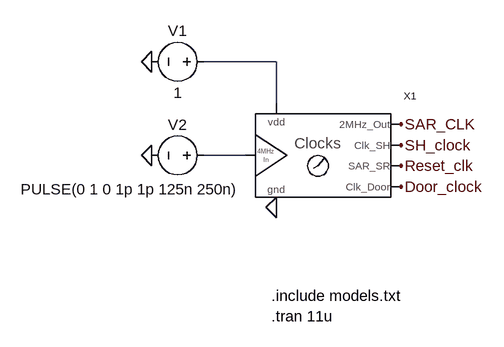
[diagram p0: schematic sim_Clocks_Block.asc]
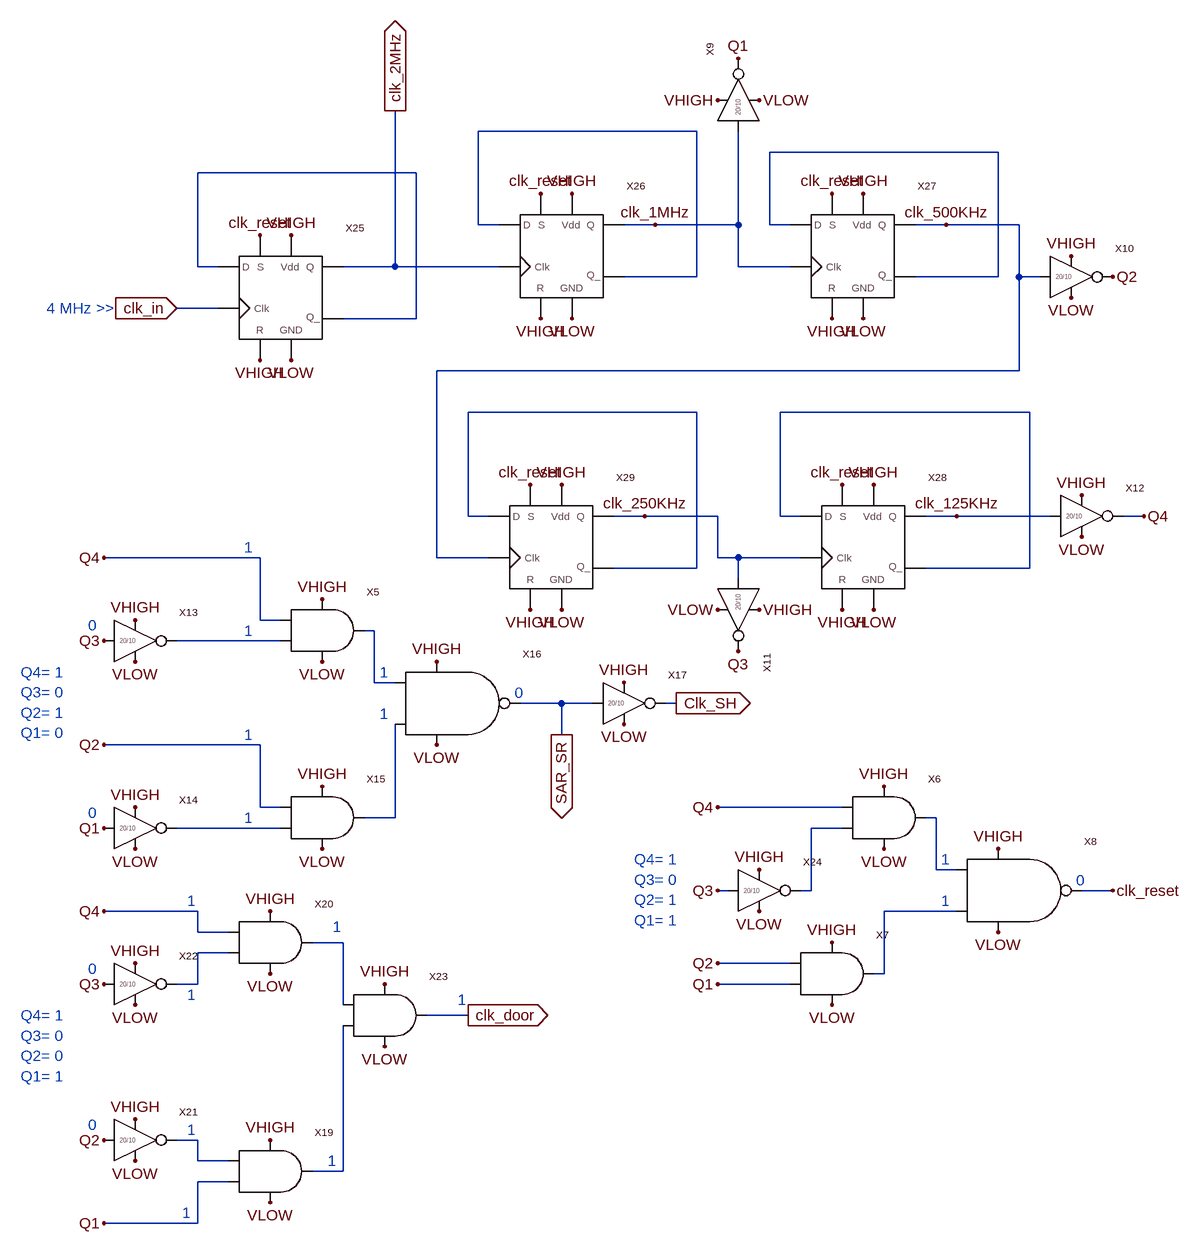
[diagram p1: sub-circuit clocks_block.asc]
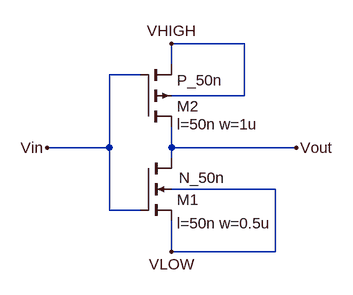
[diagram p2: sub-circuit inverter.asc]
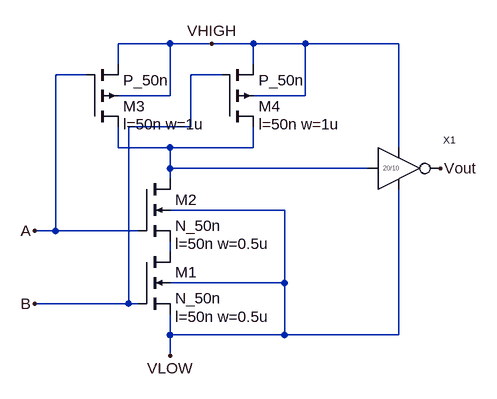
[diagram p3: sub-circuit and_t.asc]
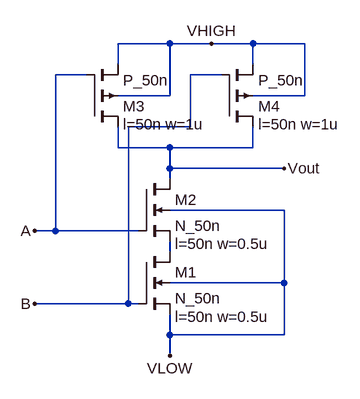
[diagram p4: sub-circuit nand.asc]
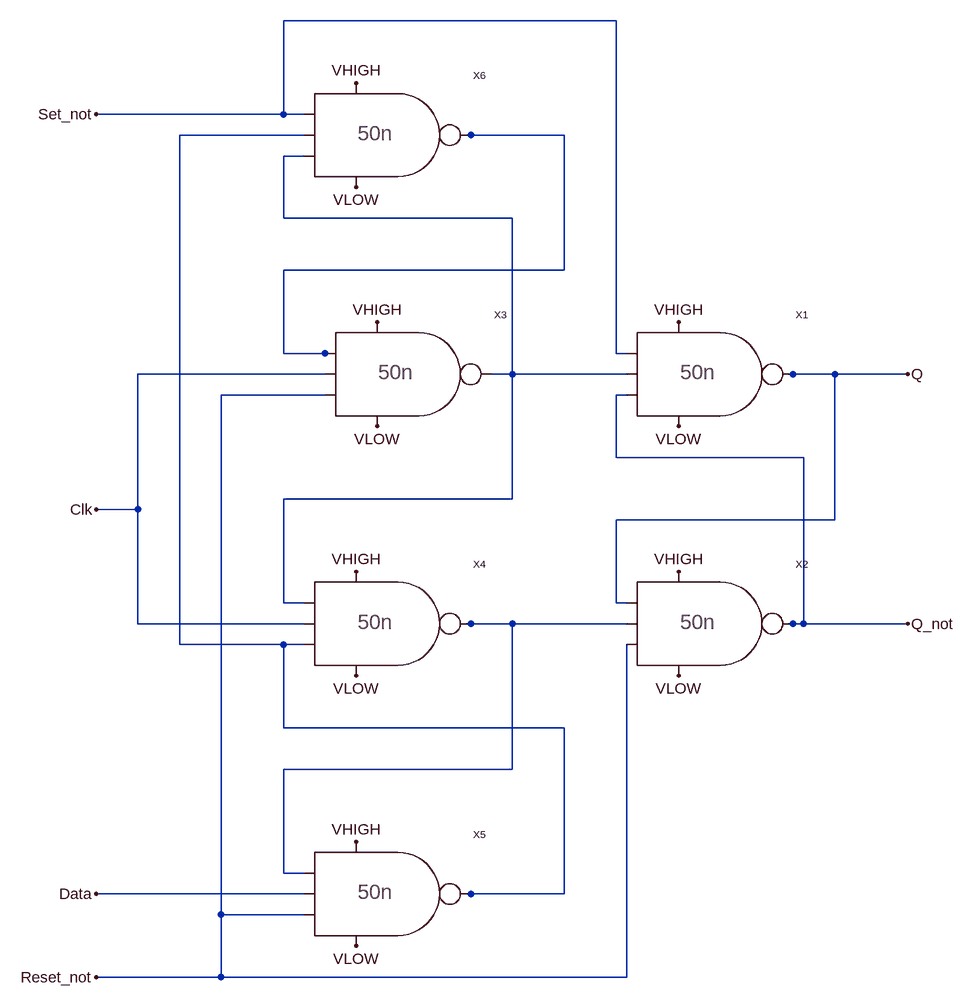
[diagram p5: sub-circuit ti_dff.asc]
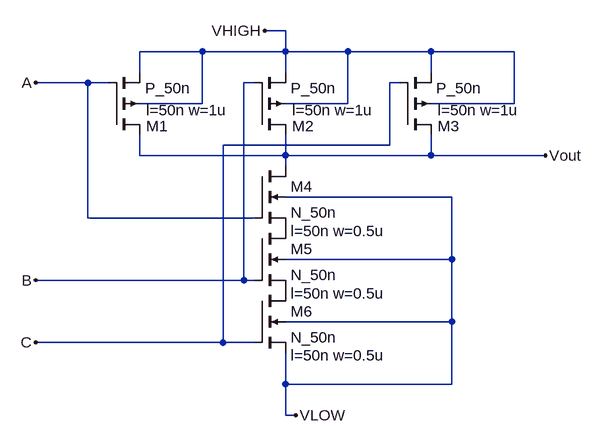
[diagram p6: sub-circuit nand3.asc]
sim_Clocks_Block.asc, the LTspice schematic file:
Version 4
SHEET 1 880 680
WIRE 272 112 160 112
WIRE 272 176 272 112
WIRE 224 256 160 256
FLAG 464 208 SAR_CLK
FLAG 464 240 SH_clock
FLAG 464 272 Reset_clk
FLAG 464 304 Door_clock
FLAG 80 256 0
FLAG 80 112 0
FLAG 272 336 0
SYMBOL voltage 176 112 R90
WINDOW 0 -32 56 VBottom 2
WINDOW 3 32 56 VTop 2
SYMATTR InstName V1
SYMATTR Value 1
SYMBOL voltage 176 256 R90
WINDOW 0 -32 56 VBottom 2
WINDOW 3 36 129 VTop 2
SYMATTR InstName V2
SYMATTR Value PULSE(0 1 0 1p 1p 125n 250n)
SYMBOL Clocks_Block 336 272 R0
SYMATTR InstName X1
TEXT 264 472 Left 2 !.include models.txt\n.tran 11u

clocks_block.asc, the sub-circuit schematic file:
Version 4
SHEET 1 3052 1676
WIRE 720 -112 384 -112
WIRE 1184 -80 832 -80
WIRE 288 -48 -48 -48
WIRE 384 32 384 -112
WIRE 416 32 384 32
WIRE 656 32 608 32
WIRE 784 32 784 -112
WIRE 784 32 656 32
WIRE 832 32 832 -80
WIRE 864 32 832 32
WIRE 1104 32 1056 32
WIRE 1216 32 1104 32
WIRE -48 96 -48 -48
WIRE -16 96 -48 96
WIRE 256 96 256 -144
WIRE 256 96 176 96
WIRE 416 96 256 96
WIRE 784 96 784 32
WIRE 864 96 784 96
WIRE 720 112 720 -112
WIRE 720 112 608 112
WIRE 1184 112 1184 -80
WIRE 1184 112 1056 112
WIRE 1216 112 1216 32
WIRE 1248 112 1216 112
WIRE -16 160 -80 160
WIRE 288 176 288 -48
WIRE 288 176 176 176
WIRE 1216 256 1216 112
WIRE 1216 256 320 256
WIRE 720 320 368 320
WIRE 1232 320 848 320
WIRE 368 480 368 320
WIRE 400 480 368 480
WIRE 640 480 592 480
WIRE 752 480 640 480
WIRE 848 480 848 320
WIRE 880 480 848 480
WIRE 1120 480 1072 480
WIRE 1264 480 1120 480
WIRE 1408 480 1376 480
WIRE 48 544 -192 544
WIRE 320 544 320 256
WIRE 400 544 320 544
WIRE 752 544 752 480
WIRE 784 544 752 544
WIRE 880 544 784 544
WIRE 720 560 720 320
WIRE 720 560 592 560
WIRE 1232 560 1232 320
WIRE 1232 560 1072 560
WIRE 784 576 784 544
WIRE 48 640 48 544
WIRE 80 640 48 640
WIRE 224 656 208 656
WIRE 80 672 -80 672
WIRE 224 736 224 656
WIRE 256 736 224 736
WIRE 512 768 448 768
WIRE 560 768 512 768
WIRE 688 768 672 768
WIRE 512 816 512 768
WIRE 48 832 -192 832
WIRE 48 928 48 832
WIRE 80 928 48 928
WIRE 944 928 752 928
WIRE 256 944 256 800
WIRE 256 944 208 944
WIRE 1088 944 1072 944
WIRE 80 960 -80 960
WIRE 944 960 896 960
WIRE 1088 1024 1088 944
WIRE 1120 1024 1088 1024
WIRE 768 1056 752 1056
WIRE 896 1056 896 960
WIRE 896 1056 880 1056
WIRE 1360 1056 1312 1056
WIRE -48 1088 -192 1088
WIRE 1120 1088 1008 1088
WIRE -48 1120 -48 1088
WIRE 0 1120 -48 1120
WIRE 176 1136 128 1136
WIRE 0 1152 -48 1152
WIRE 864 1168 752 1168
WIRE 1008 1184 1008 1088
WIRE 1008 1184 992 1184
WIRE -48 1200 -48 1152
WIRE -48 1200 -80 1200
WIRE 864 1200 752 1200
WIRE 176 1232 176 1136
WIRE 368 1248 304 1248
WIRE -48 1440 -80 1440
WIRE -48 1472 -48 1440
WIRE 0 1472 -48 1472
WIRE 176 1488 176 1264
WIRE 176 1488 128 1488
WIRE 0 1504 -48 1504
WIRE -48 1568 -48 1504
WIRE -48 1568 -192 1568
FLAG -80 160 clk_in
IOPIN -80 160 In
FLAG 656 32 clk_1MHz
FLAG 1104 32 clk_500KHz
FLAG 640 480 clk_250KHz
FLAG 784 -224 Q1
FLAG 1360 112 Q2
FLAG 784 688 Q3
FLAG 1408 480 Q4
FLAG -192 960 Q1
FLAG -192 832 Q2
FLAG -192 672 Q3
FLAG -192 544 Q4
FLAG 512 816 SAR_SR
IOPIN 512 816 Out
FLAG 688 768 Clk_SH
IOPIN 688 768 Out
FLAG 256 -144 clk_2MHz
IOPIN 256 -144 Out
FLAG 96 240 VLOW
FLAG 48 240 VHIGH
FLAG 1120 480 clk_125KHz
FLAG -192 1568 Q1
FLAG -192 1440 Q2
FLAG -192 1200 Q3
FLAG -192 1088 Q4
FLAG 368 1248 clk_door
IOPIN 368 1248 Out
FLAG 96 48 VHIGH
FLAG 528 -16 VHIGH
FLAG 480 176 VHIGH
FLAG 752 -160 VHIGH
FLAG 528 176 VLOW
FLAG 816 -160 VLOW
FLAG 752 1200 Q1
FLAG 752 1056 Q3
FLAG 752 928 Q4
FLAG 752 1168 Q2
FLAG 1360 1056 clk_reset
FLAG 944 432 clk_reset
FLAG 464 432 clk_reset
FLAG 480 -16 clk_reset
FLAG 48 48 clk_reset
FLAG 928 -16 clk_reset
FLAG 976 -16 VHIGH
FLAG 992 432 VHIGH
FLAG 944 624 VHIGH
FLAG 464 624 VHIGH
FLAG 512 624 VLOW
FLAG 992 624 VLOW
FLAG 976 176 VLOW
FLAG 928 176 VHIGH
FLAG 512 432 VHIGH
FLAG 816 624 VHIGH
FLAG 752 624 VLOW
FLAG 1312 448 VHIGH
FLAG 1312 512 VLOW
FLAG 608 800 VLOW
FLAG 608 736 VHIGH
FLAG 320 704 VHIGH
FLAG 144 608 VHIGH
FLAG 144 896 VHIGH
FLAG -144 928 VHIGH
FLAG -144 640 VHIGH
FLAG 64 1088 VHIGH
FLAG -144 1168 VHIGH
FLAG -144 1408 VHIGH
FLAG 64 1440 VHIGH
FLAG 240 1200 VHIGH
FLAG 1008 896 VHIGH
FLAG 1184 992 VHIGH
FLAG 928 1136 VHIGH
FLAG 1008 992 VLOW
FLAG 1184 1120 VLOW
FLAG 928 1232 VLOW
FLAG 816 1024 VHIGH
FLAG 816 1088 VLOW
FLAG 320 832 VLOW
FLAG 144 704 VLOW
FLAG -144 704 VLOW
FLAG -144 992 VLOW
FLAG 144 992 VLOW
FLAG 240 1296 VLOW
FLAG 64 1536 VLOW
FLAG 64 1184 VLOW
FLAG -144 1232 VLOW
FLAG -144 1472 VLOW
FLAG 1296 144 VLOW
FLAG 1296 80 VHIGH
SYMBOL Inverter 784 -128 R270
SYMATTR InstName X9
SYMBOL Inverter 1264 112 R0
SYMATTR InstName X10
SYMBOL Inverter 784 592 R90
SYMATTR InstName X11
SYMBOL Inverter 1280 480 R0
SYMATTR InstName X12
SYMBOL AND_T 96 656 R0
SYMATTR InstName X5
SYMBOL Inverter -176 672 R0
SYMATTR InstName X13
SYMBOL Inverter -176 960 R0
SYMATTR InstName X14
SYMBOL AND_T 96 944 R0
SYMATTR InstName X15
SYMBOL NAND 272 768 R0
SYMATTR InstName X16
SYMBOL Inverter 576 768 R0
SYMATTR InstName X17
SYMBOL Inverter -176 1440 R0
SYMATTR InstName X21
SYMBOL Inverter -176 1200 R0
SYMATTR InstName X22
SYMBOL AND_T 16 1488 R0
SYMATTR InstName X19
SYMBOL AND_T 16 1136 R0
SYMATTR InstName X20
SYMBOL AND_T 192 1248 R0
SYMATTR InstName X23
SYMBOL AND_T 960 944 R0
SYMATTR InstName X6
SYMBOL AND_T 880 1184 R0
SYMATTR InstName X7
SYMBOL NAND 1136 1056 R0
SYMATTR InstName X8
SYMBOL Inverter 784 1056 R0
SYMATTR InstName X24
SYMBOL TI_DFF 80 144 R0
SYMATTR InstName X25
SYMBOL TI_DFF 512 80 R0
SYMATTR InstName X26
SYMBOL TI_DFF 960 80 R0
SYMATTR InstName X27
SYMBOL TI_DFF 976 528 R0
SYMATTR InstName X28
SYMBOL TI_DFF 496 528 R0
SYMATTR InstName X29
TEXT -320 720 Left 2 ;Q4= 1\nQ3= 0\nQ2= 1\nQ1= 0
TEXT -216 648 Left 2 ;0
TEXT -216 936 Left 2 ;0
TEXT 24 528 Left 2 ;1
TEXT 24 656 Left 2 ;1
TEXT 24 816 Left 2 ;1
TEXT 24 944 Left 2 ;1
TEXT 232 784 Left 2 ;1
TEXT 232 720 Left 2 ;1
TEXT 440 752 Left 2 ;0
TEXT -320 1248 Left 2 ;Q4= 1\nQ3= 0\nQ2= 0\nQ1= 1
TEXT -216 1176 Left 2 ;0
TEXT -216 1416 Left 2 ;0
TEXT -64 1072 Left 2 ;1
TEXT -64 1216 Left 2 ;1
TEXT -64 1424 Left 2 ;1
TEXT -72 1552 Left 2 ;1
TEXT 152 1472 Left 2 ;1
TEXT 160 1112 Left 2 ;1
TEXT 352 1224 Left 2 ;1
TEXT -280 160 Left 2 ;4 MHz >>
TEXT 1096 1072 Left 2 ;1
TEXT 1096 1008 Left 2 ;1
TEXT 1304 1040 Left 2 ;0
TEXT 624 1008 Left 2 ;Q4= 1\nQ3= 0\nQ2= 1\nQ1= 1

inverter.asc, the sub-circuit schematic file:
Version 4
SHEET 1 880 680
WIRE 336 -64 224 -64
WIRE 224 -32 224 -64
WIRE 176 -16 128 -16
WIRE 336 16 336 -64
WIRE 336 16 224 16
WIRE 128 96 128 -16
WIRE 128 96 32 96
WIRE 224 96 224 64
WIRE 416 96 224 96
WIRE 224 112 224 96
WIRE 384 160 224 160
WIRE 128 192 128 96
WIRE 176 192 128 192
WIRE 224 256 224 208
WIRE 384 256 384 160
WIRE 384 256 224 256
FLAG 32 96 Vin
FLAG 224 256 VLOW
FLAG 224 -64 VHIGH
FLAG 416 96 Vout
SYMBOL nmos4 176 112 R0
WINDOW 123 56 100 Left 2
WINDOW 0 56 64 Left 2
WINDOW 3 59 30 Left 2
SYMATTR Value2 l=50n w=0.5u
SYMATTR InstName M1
SYMATTR Value N_50n
SYMBOL pmos4 176 64 M180
WINDOW 123 56 4 Left 2
SYMATTR Value2 l=50n w=1u
SYMATTR InstName M2
SYMATTR Value P_50n

and_t.asc, the sub-circuit schematic file:
Version 4
SHEET 1 880 680
WIRE 224 -128 144 -128
WIRE 288 -128 224 -128
WIRE 352 -128 288 -128
WIRE 432 -128 352 -128
WIRE 576 -128 432 -128
WIRE 144 -96 144 -128
WIRE 352 -96 352 -128
WIRE 96 -80 48 -80
WIRE 304 -80 256 -80
WIRE 224 -48 224 -128
WIRE 224 -48 144 -48
WIRE 432 -48 432 -128
WIRE 432 -48 352 -48
WIRE 256 0 256 -80
WIRE 256 0 160 0
WIRE 144 32 144 0
WIRE 224 32 144 32
WIRE 352 32 352 0
WIRE 352 32 224 32
WIRE 576 32 576 -128
WIRE 224 64 224 32
WIRE 528 64 224 64
WIRE 224 80 224 64
WIRE 400 128 224 128
WIRE 48 160 48 -80
WIRE 48 160 16 160
WIRE 176 160 48 160
WIRE 224 192 224 176
WIRE 400 240 400 128
WIRE 400 240 224 240
WIRE 160 272 160 0
WIRE 160 272 16 272
WIRE 176 272 160 272
WIRE 224 320 224 288
WIRE 400 320 400 240
WIRE 400 320 224 320
WIRE 576 320 576 96
WIRE 576 320 400 320
WIRE 224 352 224 320
FLAG 16 160 A
FLAG 16 272 B
FLAG 224 352 VLOW
FLAG 288 -128 VHIGH
FLAG 640 64 Vout
SYMBOL nmos4 176 192 R0
WINDOW 123 56 100 Left 2
SYMATTR Value2 l=50n w=0.5u
SYMATTR InstName M1
SYMATTR Value N_50n
SYMBOL nmos4 176 80 R0
WINDOW 123 56 100 Left 2
SYMATTR Value2 l=50n w=0.5u
SYMATTR InstName M2
SYMATTR Value N_50n
SYMBOL pmos4 304 0 M180
WINDOW 123 56 4 Left 2
SYMATTR Value2 l=50n w=1u
SYMATTR InstName M4
SYMATTR Value P_50n
SYMBOL pmos4 96 0 M180
WINDOW 123 56 4 Left 2
SYMATTR Value2 l=50n w=1u
SYMATTR InstName M3
SYMATTR Value P_50n
SYMBOL Inverter 544 64 R0
SYMATTR InstName X1

nand.asc, the sub-circuit schematic file:
Version 4
SHEET 1 880 680
WIRE 224 -128 144 -128
WIRE 288 -128 224 -128
WIRE 352 -128 288 -128
WIRE 432 -128 352 -128
WIRE 144 -96 144 -128
WIRE 352 -96 352 -128
WIRE 96 -80 48 -80
WIRE 304 -80 256 -80
WIRE 224 -48 224 -128
WIRE 224 -48 144 -48
WIRE 432 -48 432 -128
WIRE 432 -48 352 -48
WIRE 256 0 256 -80
WIRE 256 0 160 0
WIRE 144 32 144 0
WIRE 224 32 144 32
WIRE 352 32 352 0
WIRE 352 32 224 32
WIRE 224 64 224 32
WIRE 400 64 224 64
WIRE 224 80 224 64
WIRE 400 128 224 128
WIRE 48 160 48 -80
WIRE 48 160 16 160
WIRE 176 160 48 160
WIRE 224 192 224 176
WIRE 400 240 400 128
WIRE 400 240 224 240
WIRE 160 272 160 0
WIRE 160 272 16 272
WIRE 176 272 160 272
WIRE 224 320 224 288
WIRE 400 320 400 240
WIRE 400 320 224 320
WIRE 224 352 224 320
FLAG 16 160 A
FLAG 16 272 B
FLAG 224 352 VLOW
FLAG 400 64 Vout
FLAG 288 -128 VHIGH
SYMBOL nmos4 176 192 R0
WINDOW 123 56 100 Left 2
SYMATTR Value2 l=50n w=0.5u
SYMATTR InstName M1
SYMATTR Value N_50n
SYMBOL nmos4 176 80 R0
WINDOW 123 56 100 Left 2
SYMATTR Value2 l=50n w=0.5u
SYMATTR InstName M2
SYMATTR Value N_50n
SYMBOL pmos4 304 0 M180
WINDOW 123 56 4 Left 2
SYMATTR Value2 l=50n w=1u
SYMATTR InstName M4
SYMATTR Value P_50n
SYMBOL pmos4 96 0 M180
WINDOW 123 56 4 Left 2
SYMATTR Value2 l=50n w=1u
SYMATTR InstName M3
SYMATTR Value P_50n

ti_dff.asc, the sub-circuit schematic file:
Version 4
SHEET 1 1216 1124
WIRE 160 -416 -352 -416
WIRE -352 -272 -352 -416
WIRE -352 -272 -640 -272
WIRE -320 -272 -352 -272
WIRE -320 -240 -512 -240
WIRE -64 -240 -80 -240
WIRE 80 -240 -64 -240
WIRE -320 -208 -352 -208
WIRE -352 -112 -352 -208
WIRE 0 -112 -352 -112
WIRE 80 -32 80 -240
WIRE 80 -32 -352 -32
WIRE -352 96 -352 -32
WIRE -288 96 -352 96
WIRE -272 96 -288 96
WIRE 160 96 160 -416
WIRE 176 96 160 96
WIRE -288 128 -576 128
WIRE 0 128 0 -112
WIRE 0 128 -32 128
WIRE 176 128 0 128
WIRE 432 128 416 128
WIRE 496 128 432 128
WIRE 608 128 496 128
WIRE -288 160 -448 160
WIRE 176 160 160 160
WIRE 160 256 160 160
WIRE 448 256 160 256
WIRE 0 320 0 128
WIRE 0 320 -352 320
WIRE -576 336 -576 128
WIRE -576 336 -640 336
WIRE 496 352 496 128
WIRE 496 352 160 352
WIRE -352 480 -352 320
WIRE -320 480 -352 480
WIRE 160 480 160 352
WIRE 176 480 160 480
WIRE -576 512 -576 336
WIRE -320 512 -576 512
WIRE -64 512 -80 512
WIRE 0 512 -64 512
WIRE 176 512 0 512
WIRE 432 512 416 512
WIRE 448 512 448 256
WIRE 448 512 432 512
WIRE 608 512 448 512
WIRE -512 544 -512 -240
WIRE -352 544 -512 544
WIRE -320 544 -352 544
WIRE -352 672 -352 544
WIRE 80 672 -352 672
WIRE 0 736 0 512
WIRE 0 736 -352 736
WIRE -352 896 -352 736
WIRE -320 896 -352 896
WIRE -320 928 -640 928
WIRE -64 928 -80 928
WIRE 80 928 80 672
WIRE 80 928 -64 928
WIRE -448 960 -448 160
WIRE -320 960 -448 960
WIRE -448 1056 -448 960
WIRE -448 1056 -640 1056
WIRE 176 1056 176 544
WIRE 176 1056 -448 1056
FLAG -640 -272 Set_not
FLAG -640 928 Data
FLAG -640 336 Clk
FLAG -640 1056 Reset_not
FLAG 608 128 Q
FLAG 608 512 Q_not
FLAG -240 848 VHIGH
FLAG -240 432 VHIGH
FLAG 256 432 VHIGH
FLAG -240 -320 VHIGH
FLAG -208 48 VHIGH
FLAG 256 48 VHIGH
FLAG -240 -160 VLOW
FLAG -208 208 VLOW
FLAG 256 208 VLOW
FLAG -240 1008 VLOW
FLAG 256 592 VLOW
FLAG -240 592 VLOW
SYMBOL NAND3 240 128 R0
SYMATTR InstName X1
SYMBOL NAND3 240 512 R0
SYMATTR InstName X2
SYMBOL NAND3 -224 128 R0
SYMATTR InstName X3
SYMBOL NAND3 -256 512 R0
SYMATTR InstName X4
SYMBOL NAND3 -256 928 R0
SYMATTR InstName X5
SYMBOL NAND3 -256 -240 R0
SYMATTR InstName X6

nand3.asc, the sub-circuit schematic file:
Version 4
SHEET 1 880 788
WIRE 320 -96 288 -96
WIRE 192 -64 96 -64
WIRE 320 -64 320 -96
WIRE 320 -64 192 -64
WIRE 416 -64 320 -64
WIRE 544 -64 416 -64
WIRE 672 -64 544 -64
WIRE 96 -32 96 -64
WIRE 320 -32 320 -64
WIRE 544 -32 544 -64
WIRE 16 -16 -64 -16
WIRE 48 -16 16 -16
WIRE 272 -16 256 -16
WIRE 496 -16 480 -16
WIRE 192 16 192 -64
WIRE 192 16 96 16
WIRE 416 16 416 -64
WIRE 416 16 320 16
WIRE 672 16 672 -64
WIRE 672 16 544 16
WIRE 480 80 480 -16
WIRE 480 80 224 80
WIRE 96 96 96 64
WIRE 320 96 320 64
WIRE 320 96 96 96
WIRE 544 96 544 64
WIRE 544 96 320 96
WIRE 720 96 544 96
WIRE 320 112 320 96
WIRE 576 160 320 160
WIRE 16 192 16 -16
WIRE 272 192 16 192
WIRE 576 256 576 160
WIRE 576 256 320 256
WIRE 256 288 256 -16
WIRE 256 288 -64 288
WIRE 272 288 256 288
WIRE 576 352 576 256
WIRE 576 352 320 352
WIRE 224 384 224 80
WIRE 224 384 -64 384
WIRE 272 384 224 384
WIRE 320 448 320 400
WIRE 576 448 576 352
WIRE 576 448 320 448
WIRE 320 496 320 448
WIRE 336 496 320 496
FLAG -64 -16 A
FLAG -64 288 B
FLAG -64 384 C
FLAG 720 96 Vout
FLAG 288 -96 VHIGH
FLAG 336 496 VLOW
SYMBOL pmos4 272 64 M180
WINDOW 0 58 13 Left 2
WINDOW 123 58 38 Left 2
SYMATTR InstName M2
SYMATTR Value2 l=50n w=1u
SYMATTR Value P_50n
SYMBOL pmos4 48 64 M180
WINDOW 0 58 13 Left 2
WINDOW 123 58 38 Left 2
SYMATTR InstName M1
SYMATTR Value2 l=50n w=1u
SYMATTR Value P_50n
SYMBOL pmos4 496 64 M180
WINDOW 0 58 13 Left 2
WINDOW 123 58 38 Left 2
SYMATTR InstName M3
SYMATTR Value2 l=50n w=1u
SYMATTR Value P_50n
SYMBOL nmos4 272 112 R0
WINDOW 123 56 100 Left 2
SYMATTR Value2 l=50n w=0.5u
SYMATTR InstName M4
SYMATTR Value N_50n
SYMBOL nmos4 272 208 R0
WINDOW 123 56 100 Left 2
SYMATTR Value2 l=50n w=0.5u
SYMATTR InstName M5
SYMATTR Value N_50n
SYMBOL nmos4 272 304 R0
WINDOW 123 56 100 Left 2
SYMATTR Value2 l=50n w=0.5u
SYMATTR InstName M6
SYMATTR Value N_50n

The netlist it stands for:
* sim_Clocks_Block.asc
V1 N001 0 1
V2 N002 0 PULSE(0 1 0 1p 1p 125n 250n)
XX1 SH_clock Reset_clk Door_clock N002 N001 0 SAR_CLK clocks_block

* block symbol definitions
.subckt clocks_block Clk_SH SAR_SR clk_door clk_in VHIGH VLOW clk_2MHz
XX9 VHIGH VLOW clk_1MHz Q1 inverter
XX10 VHIGH VLOW clk_500KHz Q2 inverter
XX11 VHIGH VLOW clk_250KHz Q3 inverter
XX12 VHIGH VLOW clk_125KHz Q4 inverter
XX5 N006 VHIGH VLOW Q4 N007 and_t
XX13 VHIGH VLOW Q3 N007 inverter
XX14 VHIGH VLOW Q1 N010 inverter
XX15 N008 VHIGH VLOW Q2 N010 and_t
XX16 VHIGH VLOW SAR_SR N006 N008 nand
XX17 VHIGH VLOW SAR_SR Clk_SH inverter
XX21 VHIGH VLOW Q2 N015 inverter
XX22 VHIGH VLOW Q3 N014 inverter
XX19 N016 VHIGH VLOW N015 Q1 and_t
XX20 N013 VHIGH VLOW Q4 N014 and_t
XX23 clk_door VHIGH VLOW N013 N016 and_t
XX6 N009 VHIGH VLOW Q4 N011 and_t
XX7 N012 VHIGH VLOW Q2 Q1 and_t
XX8 VHIGH VLOW clk_reset N009 N012 nand
XX24 VHIGH VLOW Q3 N011 inverter
XX25 clk_reset clk_in N003 VHIGH clk_2MHz N003 VLOW VHIGH ti_dff
XX26 clk_reset clk_2MHz N001 VHIGH clk_1MHz N001 VLOW VHIGH ti_dff
XX27 clk_reset clk_1MHz N002 VHIGH clk_500KHz N002 VLOW VHIGH ti_dff
XX28 clk_reset clk_250KHz N005 VHIGH clk_125KHz N005 VLOW VHIGH ti_dff
XX29 clk_reset clk_500KHz N004 VHIGH clk_250KHz N004 VLOW VHIGH ti_dff
* Q4= 1
* Q3= 0
* Q2= 1
* Q1= 0
* 0
* 0
* 1
* 1
* 1
* 1
* 1
* 1
* 0
* Q4= 1
* Q3= 0
* Q2= 0
* Q1= 1
* 0
* 0
* 1
* 1
* 1
* 1
* 1
* 1
* 1
* 4 MHz >>
* 1
* 1
* 0
* Q4= 1
* Q3= 0
* Q2= 1
* Q1= 1
.ends clocks_block

.subckt inverter VHIGH VLOW Vin Vout
M1 Vout Vin VLOW VLOW N_50n l=50n w=0.5u
M2 Vout Vin VHIGH VHIGH P_50n l=50n w=1u
.ends inverter

.subckt and_t Vout VHIGH VLOW A B
M1 N002 B VLOW VLOW N_50n l=50n w=0.5u
M2 N001 A N002 VLOW N_50n l=50n w=0.5u
M4 N001 B VHIGH VHIGH P_50n l=50n w=1u
M3 N001 A VHIGH VHIGH P_50n l=50n w=1u
XX1 VHIGH VLOW N001 Vout inverter
.ends and_t

.subckt nand VHIGH VLOW Vout A B
M1 N001 B VLOW VLOW N_50n l=50n w=0.5u
M2 Vout A N001 VLOW N_50n l=50n w=0.5u
M4 Vout B VHIGH VHIGH P_50n l=50n w=1u
M3 Vout A VHIGH VHIGH P_50n l=50n w=1u
.ends nand

.subckt ti_dff Set_not Clk Data Reset_not Q Q_not VLOW VHIGH
XX1 Set_not N003 Q_not Q VHIGH VLOW nand3
XX2 Q N004 Reset_not Q_not VHIGH VLOW nand3
XX3 N002 Clk Reset_not N003 VHIGH VLOW nand3
XX4 N003 Clk N001 N004 VHIGH VLOW nand3
XX5 N004 Data Reset_not N001 VHIGH VLOW nand3
XX6 Set_not N001 N003 N002 VHIGH VLOW nand3
.ends ti_dff

.subckt nand3 A B C Vout VHIGH VLOW
M2 Vout B VHIGH VHIGH P_50n l=50n w=1u
M1 Vout A VHIGH VHIGH P_50n l=50n w=1u
M3 Vout C VHIGH VHIGH P_50n l=50n w=1u
M4 Vout A P001 VLOW N_50n l=50n w=0.5u
M5 P001 B P002 VLOW N_50n l=50n w=0.5u
M6 P002 C VLOW VLOW N_50n l=50n w=0.5u
.ends nand3

.model NMOS NMOS
.model PMOS PMOS
.lib standard.mos
.include models.txt
.tran 11u
.backanno
.end